# Altium schematic sheet AudioAmp.SchDoc: =ProjectTitle
size B; Engineer: H. Collector; Organization: IMR Engineering; Address1: 3621 Gin Way; Address2: Snellville, GA 30039; Address3: USA; SheetNumber: 8; SheetTotal: 10
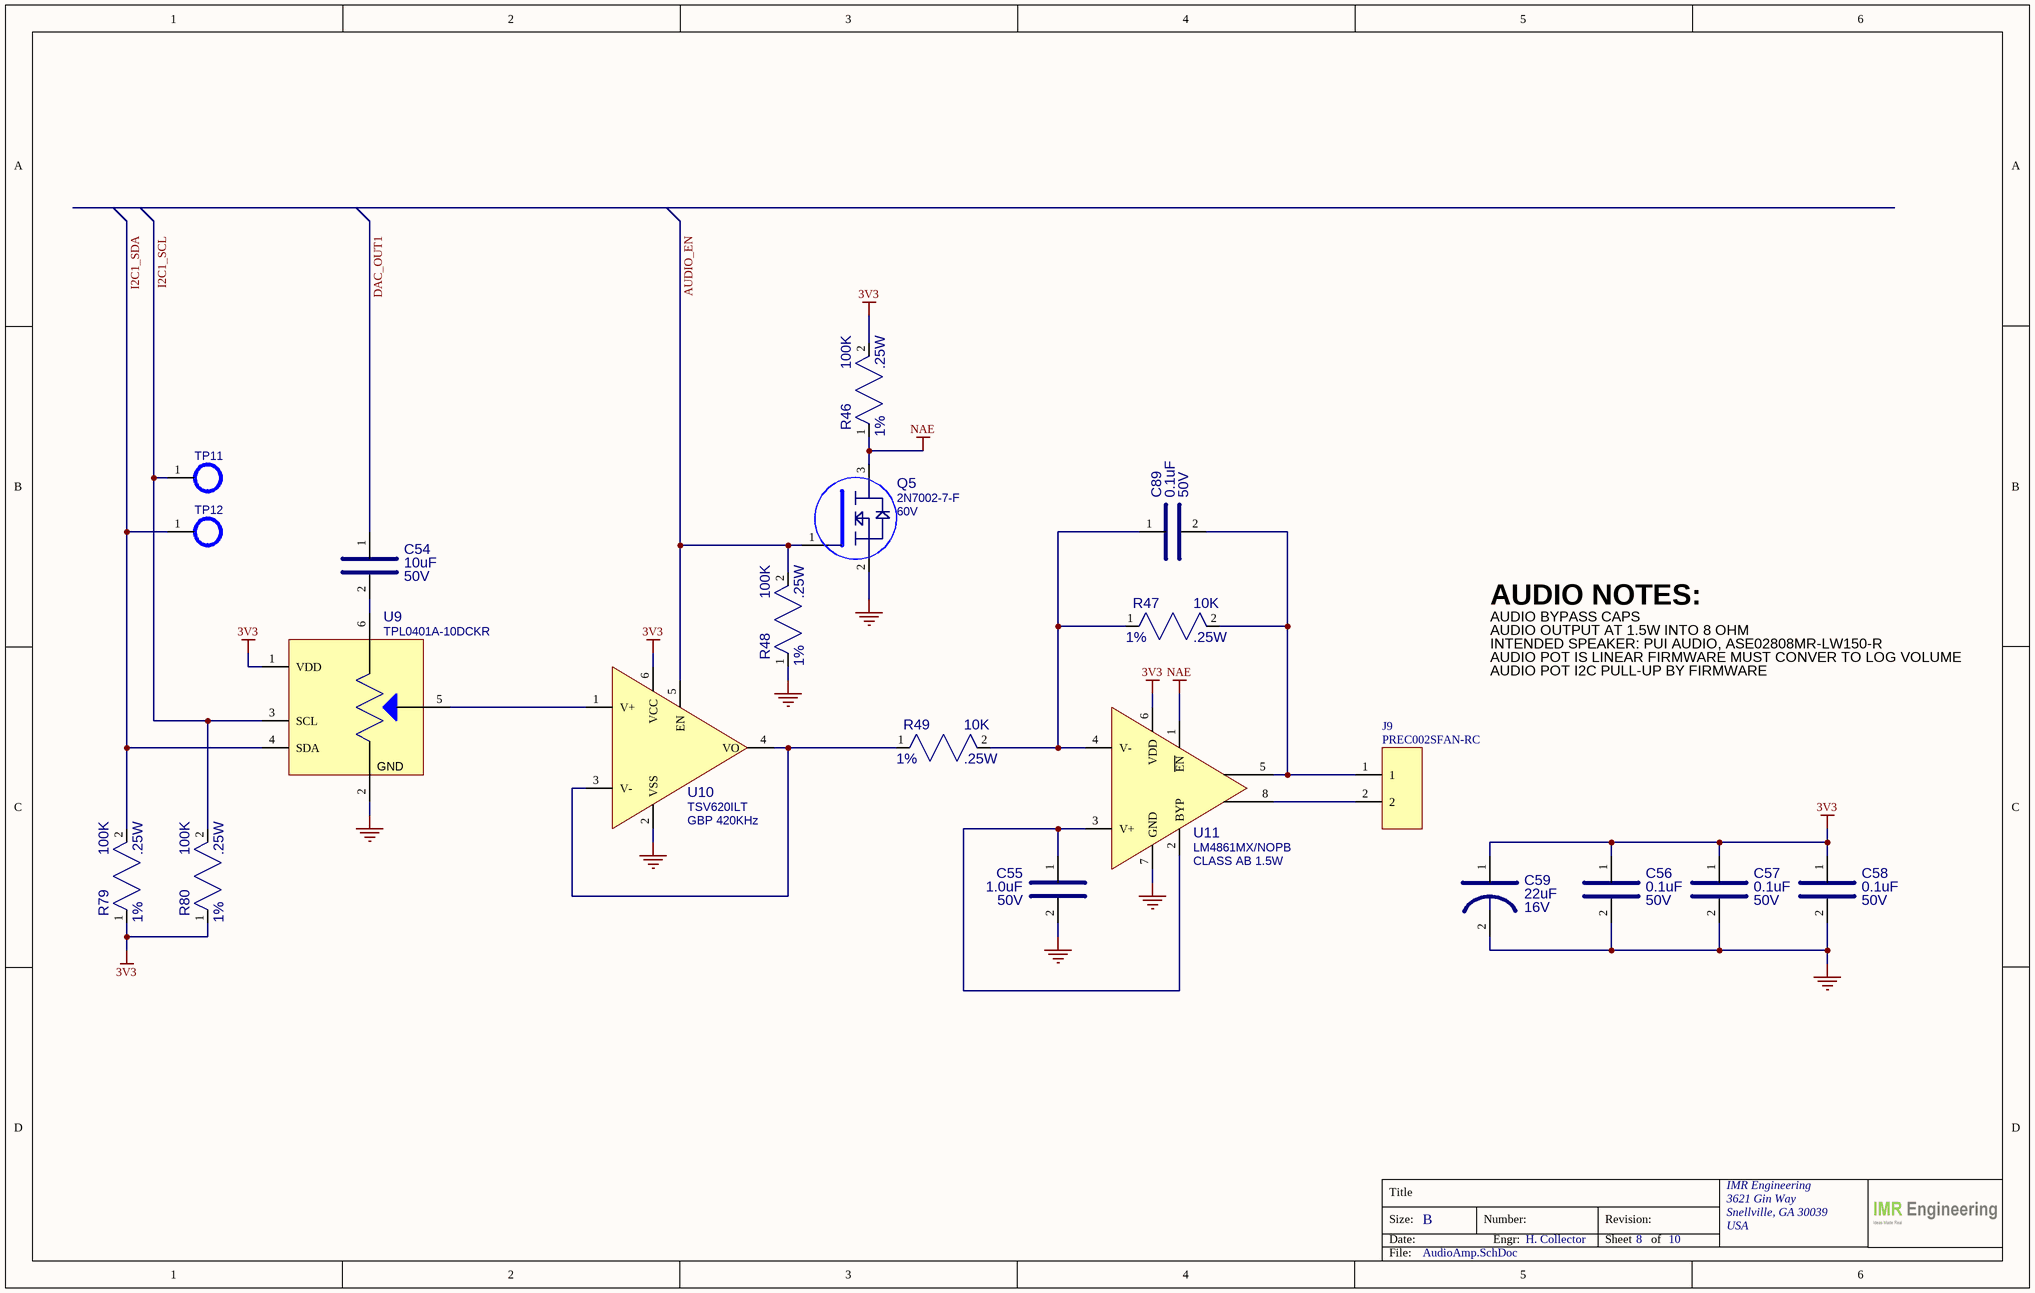
[diagram p0: AudioAmp.SchDoc]

## Parts
C54  value 10uF  VOLTAGE: 50V  [CAP_1206]  (hidden comment: CL31A106KBHNNNE)
C55  value 1.0uF  VOLTAGE: 50V  [CAP_0805]  (hidden comment: UMK212B7105MGHT)
C56  value 0.1uF  VOLTAGE: 50V  [CAP_0805]  (hidden comment: 08055C104KAT2A)
C57  value 0.1uF  VOLTAGE: 50V  [CAP_0805]  (hidden comment: 08055C104KAT2A)
C58  value 0.1uF  VOLTAGE: 50V  [CAP_0805]  (hidden comment: 08055C104KAT2A)
C59  value 22uF  VOLTAGE: 16V  [CAP_2312]  (hidden comment: TRJC226K016RRJ)
C89  value 0.1uF  VOLTAGE: 50V  [CAP_0805]  (hidden comment: 08055C104KAT2A)
J9  PREC002SFAN-RC  [HDR_1X2_100MILL]
Q5  value 60V  [SOT-23]  (hidden comment: 2N7002-7-F)
R46  value 100K  TOLERANCE: 1%  POWER: .25W  [PMG_RES_0805]  (hidden comment: RK73H2ATTD1003F)
R47  value 10K  TOLERANCE: 1%  POWER: .25W  [RES_0805]  (hidden comment: SG73S2ATTD1002F)
R48  value 100K  TOLERANCE: 1%  POWER: .25W  [PMG_RES_0805]  (hidden comment: RK73H2ATTD1003F)
R49  value 10K  TOLERANCE: 1%  POWER: .25W  [RES_0805]  (hidden comment: SG73S2ATTD1002F)
R79  value 100K  TOLERANCE: 1%  POWER: .25W  [PMG_RES_0805]  (hidden comment: RK73H2ATTD1003F)
R80  value 100K  TOLERANCE: 1%  POWER: .25W  [PMG_RES_0805]  (hidden comment: RK73H2ATTD1003F)
TP11  TP_0635MM_HOLE  [TP_0635MM_HOLE]  (value not drawn)  (no BOM)
TP12  TP_0635MM_HOLE  [TP_0635MM_HOLE]  (value not drawn)  (no BOM)
U9  value 10K  TOLERANCE: 20%  POWER: 5.5V  [SOT-363_6-TSSOP_SC-88]  (hidden comment: TPL0401A-10DCKR)
U10  value GBP 420KHz  [SOT23-6]  (hidden comment: TSV620ILT)
U11  value CLASS AB 1.5W  [SO-8]  (hidden comment: LM4861MX/NOPB)

## Nets
3V3: C56.1 C57.1 C58.1 C59.1 R46.2 R79.1 R80.1 U9.1(VDD) U10.6(VCC) U11.6(VDD)
GND: C55.2 C56.2 C57.2 C58.2 C59.2 Q5.2(E) R48.1 U9.2(GND) U10.2(VSS) U11.7(GND)
NAE: Q5.3(C) R46.1 U11.1(~{EN})
AUDIO_EN: Q5.1(B) R48.2 U10.5(EN)
DAC_OUT1: C54.1
I2C1_SCL: R80.2 TP11.1 U9.3(SCL)
I2C1_SDA: R79.2 TP12.1 U9.4(SDA)
NetC54_2: C54.2 U9.6(H)
NetC55_1: C55.1 U11.2(BYP) U11.3(V+)
NetC89_1: C89.1 R47.1 R49.2 U11.4(V-)
NetC89_2: C89.2 J9.1 R47.2 U11.5(VO1)
NetJ9_2: J9.2 U11.8(VO2)
NetR49_1: R49.1 U10.3(V-) U10.4(VO)
NetU9_5: U9.5(W) U10.1(V+)

## Notes on the sheet
- AUDIO NOTES:
- AUDIO BYPASS CAPS
- AUDIO OUTPUT AT 1.5W INTO 8 OHM
- INTENDED SPEAKER: PUI AUDIO, ASE02808MR-LW150-R
- AUDIO POT IS LINEAR FIRMWARE MUST CONVER TO LOG VOLUME
- AUDIO POT I2C PULL-UP BY FIRMWARE
- Title
- Size:
- Date:
- B
- Number:
- Engr:
- Revision:
- Sheet
- of
- File:

## Library data of the parts
C54 = CAP_10UF_50V_1206: CAP CER 10UF 50V X5R 1206; MFG: Samsung Electro-Mechanics; TOLERANCE: 10%; MFG_PN: CL31A106KBHNNNE; Supplier 1: Digi-Key; Supplier Part Number 1: 1276-2876-1-ND; Case/Package: 0805
C55 = CAP_1.0UF_50V_0805: CAP CER 1UF 50V X7R 0805; MFG: Taiyo Yuden; TOLERANCE: 20%; MFG_PN: UMK212B7105MGHT; Supplier 1: Digi-Key; Supplier Part Number 1: 587-6375-1-ND; Case/Package: 0805
C56-C58 C89 = CAP_0.1UF_50V_0805: CAP CER 0.1UF 50V X7R 0805; MFG: AVX; TOLERANCE: 10%; MFG_PN: 08055C104KAT2A; Supplier 1: Digi-Key; Supplier Part Number 1: 478-1395-1-ND; Case/Package: 0805
C59 = CAP_22UF_16V_TANT: CAP TANT 22UF 20% 16V 2312; MFG: AVX Corporation; TOLERANCE: 10%; MFG_PN: TRJC226K016RRJ; Supplier 1: Digi-Key; Supplier Part Number 1: 478-11127-1-ND
J9 = CONN_2P_SINGLE_ROW: CONN HEADER VERT 2POS 2.54MM; MFG: Sullins Connector Solutions; Case/Package: 2P_2.54MM; MFG_PN: PREC002SFAN-RC; Supplier 1: Digi-Key; Supplier Part Number 1: S1212EC-02-ND; Value: *
Q5 = MOSFET_NCH_2N7002-7-F: MOSFET N-CH 60V 115MA SOT23-3; MFG: Diodes Incorporated; Case/Package: SOT-23; Supplier 1: Digi-Key; Supplier Part Number 1: 2N7002-FDICT-ND; MFG_PN: 2N7002-7-F
R46 R48 R79 R80 = RES_100K_0805_1/4W_1%: RES SMD 100K OHM 1% 1/4W 0805; MFG: KOA Speer Electronics, Inc.; Case/Package: 0805; MFG_PN: RK73H2ATTD1003F; Supplier 1: Digi-Key; Supplier Part Number 1: 2019-RK73H2ATTD1003FCT-ND
  R79 R80: ClassName: UI_Module
R47 R49 = RES_10K_0805_1/4W_1%: RES SMD 10K OHM 1% 1/4W 0805; MFG: KOA Speer Electronics, Inc.; Case/Package: 0805; MFG_PN: SG73S2ATTD1002F; Supplier 1: Digi-Key; Supplier Part Number 1: 2019-SG73S2ATTD1002FCT-ND
TP11 TP12 = TP_0635MM_HOLE: 3MM IN D. MT HOLE
U9 = IC_TPL0401A-10DCKR: IC DGTL POT 10KOHM 128TAP SC70-6; MFG: Texas Instruments; Case/Package: SC70-6; MFG_PN: TPL0401A-10DCKR; Supplier 1: Digi-Key; Supplier Part Number 1: 296-29676-1-ND
U10 = IC_OPAMP_TSV620ILT: IC OPAMP GP 1 CIRCUIT SOT23-6; MFG: STMicroelectronics; Supplier 1: Digi-Key; Supplier Part Number 1: 497-10160-1-ND; Case/Package: SOT23-6; MFG_PN: TSV620ILT
U11 = IC_OPAMP_LM4861: IC AMP CLASS AB MONO 1.5W 8SOIC; MFG: Texas Instruments; Supplier 1: Digi-Key; Supplier Part Number 1: 296-38566-1-ND; Case/Package: 8SOIC; MFG_PN: LM4861MX/NOPB